# EAGLE design CUI32Stem (EAGLE 5.10)
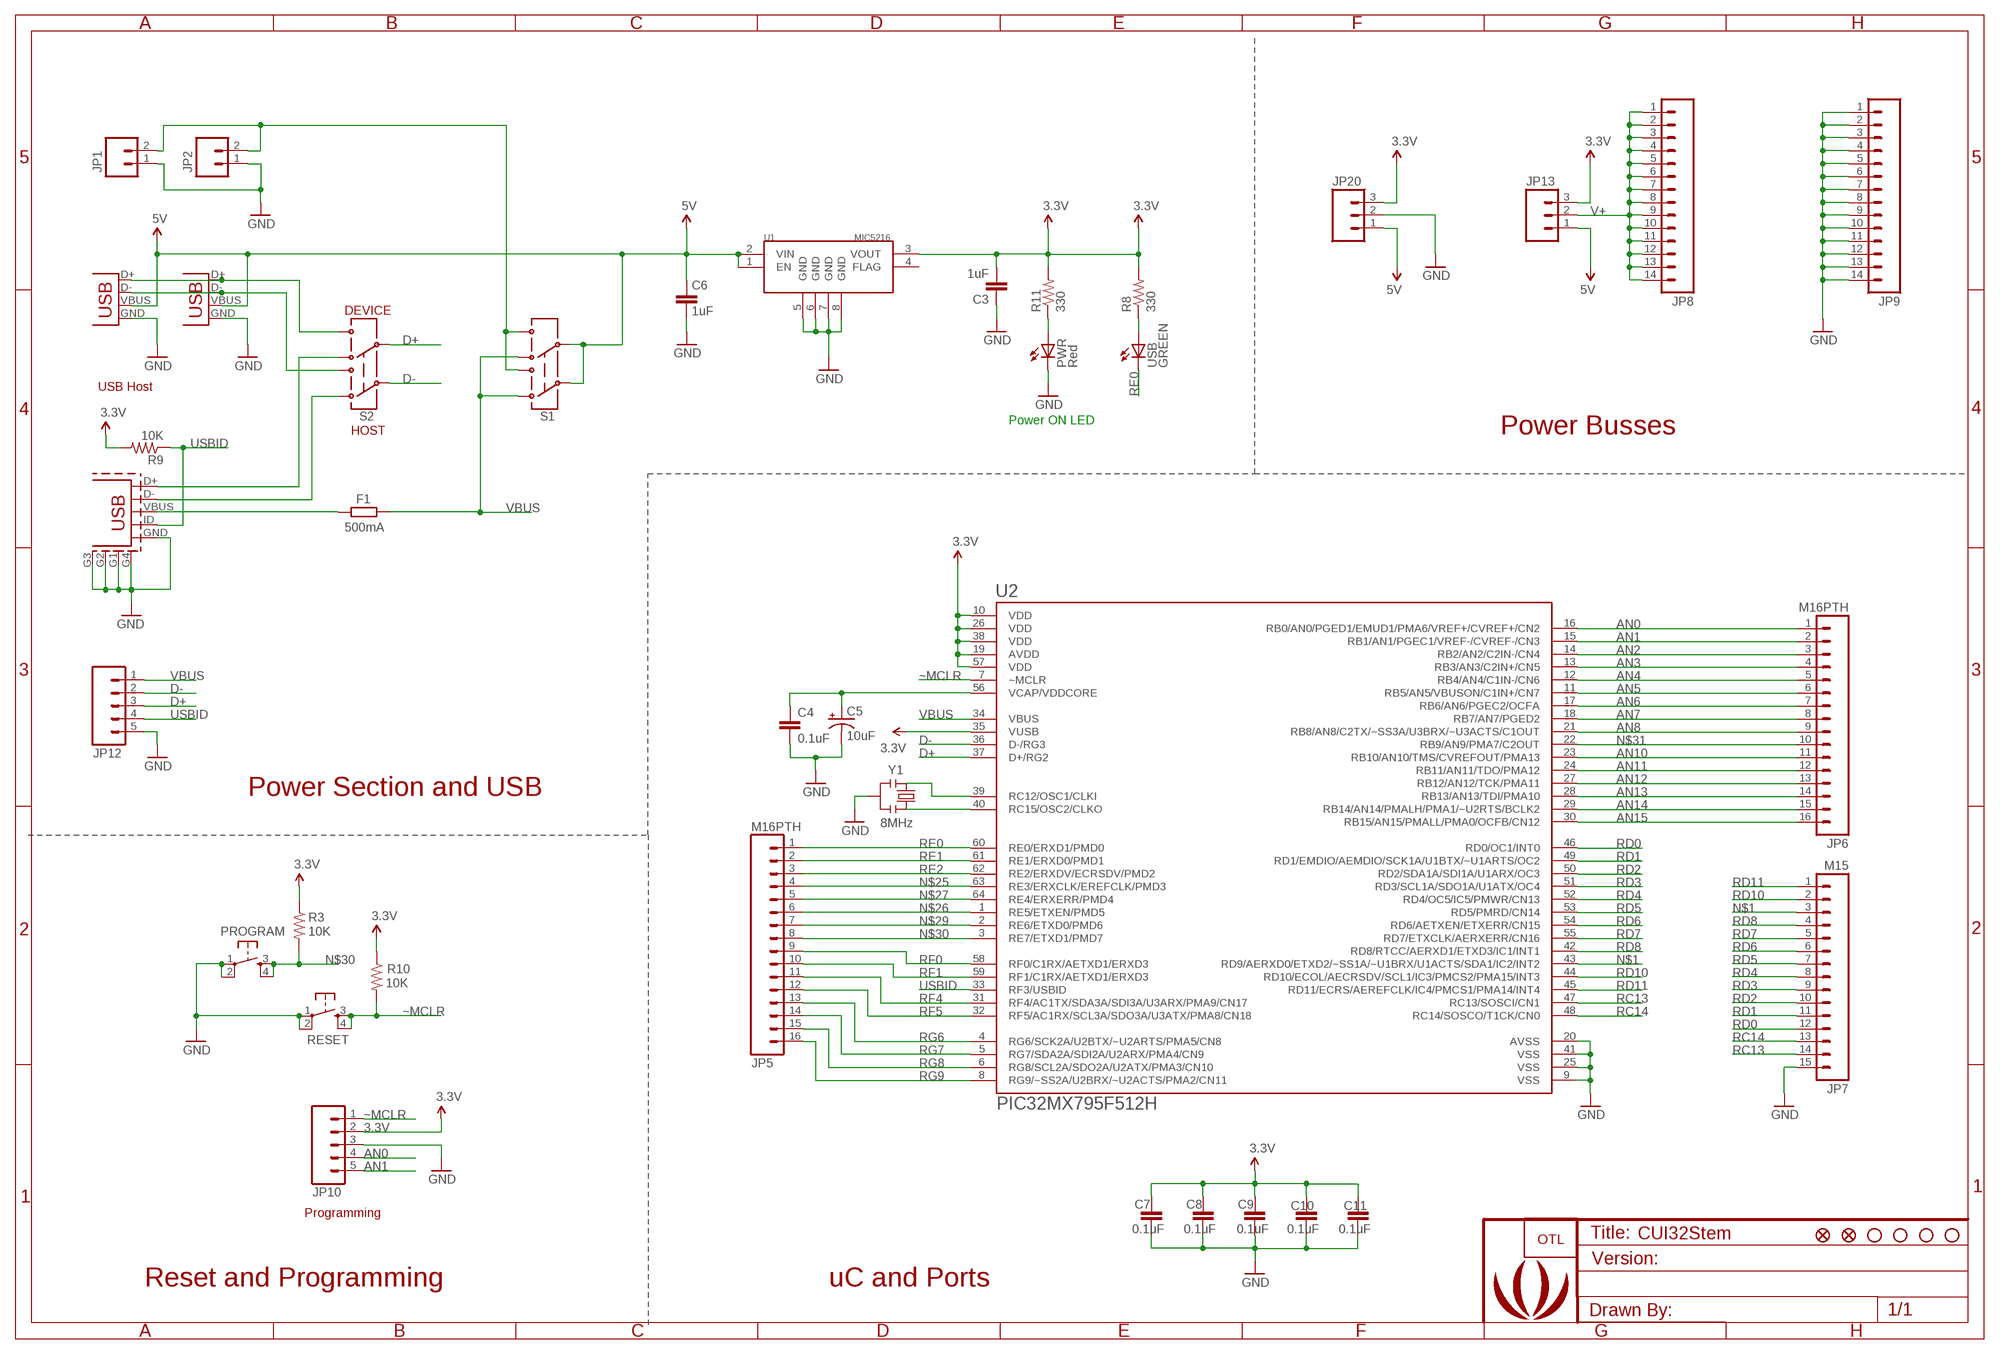
[diagram p0: schematic, sheet 1]

## Parts
C3  1uF  CAP0402-CAP  [0402-CAP]
C4  0.1uF  CAP0402-CAP  [0402-CAP]
C5  10uF  CAP_POL1206  [EIA3216]
C6  1uF  CAP0402-CAP  [0402-CAP]
C7  0.1uF  CAP0402-CAP  [0402-CAP]
C8  0.1uF  CAP0402-CAP  [0402-CAP]
C9  0.1uF  CAP0402-CAP  [0402-CAP]
C10  0.1uF  CAP0402  [C0402]
C11  0.1uF  CAP0402-CAP  [0402-CAP]
F1  500mA  R-EU_R1206  [R1206]
JP1  M02-JST-2MM-SMT  [S2B-PH]
JP2  M02PTH  [1X02]
JP3  USB_5PIN  [USB-MINIB]
JP4  FIDUCIAL1X2  [FIDUCIAL-1X2]
JP5  M16PTH  [1X16]
JP6  M16PTH  [1X16]
JP7  M15  [1X15]
JP8  M14  [1X14]
JP9  M14  [1X14]
JP10  M05PTH  [1X05]
JP11  USB  [USB-A-S-NOSILK-FEMALE]
JP12  M05PTH  [1X05]
JP13  M03PTH  [1X03]
JP14  STAND-OFF  [STAND-OFF]
JP15  STAND-OFF  [STAND-OFF]
JP16  STAND-OFF  [STAND-OFF]
JP17  STAND-OFF  [STAND-OFF]
JP18  FIDUCIAL1X2  [FIDUCIAL-1X2]
JP19  USB  [USB-A-S-NOSILK-FEMALE]
JP20  M03PTH  [1X03]
PROGRAM  TAC_SWITCHSND  [TACTILE_SWITCH_SMD]
PWR  Red  LED0603  [LED-0603]
R3  10K  RESISTOR0402-RES  [0402-RES]
R8  330  RESISTOR0402-RES  [0402-RES]
R9  10K  RESISTOR0402-RES  [0402-RES]
R10  10K  RESISTOR0402-RES  [0402-RES]
R11  330  RESISTOR0402-RES  [0402-RES]
RESET  TAC_SWITCHSND  [TACTILE_SWITCH_SMD]
S1  AYZ0202  [AYZ0202]
S2  AYZ0202  [AYZ0202]
U1  MIC5216  VREG_MIC5216  [MSOP8]
U2  PIC32MX795F512H  [SQFP-S-10X10-64]
U$2  LOGO-SEEEDSTUDIO-SILK  [LOGO_SILK]
U$5  LOGO-OTL  [OVERTONE_LOGO]
USB  GREEN  LED0603  [LED-0603]
Y1  8MHz  RESONATORSMD  [RESONATOR-SMD]

## Nets
3.3V: C3.2 C7.1 C8.1 C9.1 C10.1 C11.1 JP10.2 JP13.3 JP20.3 R3.1 R8.2 R9.2 R10.1 R11.2 U1.3(VOUT) U2.10(VDD) U2.19(AVDD) U2.26(VDD) U2.35(VUSB) U2.38(VDD) U2.57(VDD)
5V: C6.2 JP11.VBUS JP13.1 JP19.VBUS JP20.1 S1.2 S1.5 U1.1(EN) U1.2(VIN)
5V_ALT: JP1.2 JP2.2 S1.1 S1.4
AN0: JP6.1 JP10.4 U2.16(RB0/AN0/PGED1/EMUD1/PMA6/VREF+/CVREF+/CN2)
AN1: JP6.2 JP10.5 U2.15(RB1/AN1/PGEC1/VREF-/CVREF-/CN3)
AN2: JP6.3 U2.14(RB2/AN2/C2IN-/CN4)
AN3: JP6.4 U2.13(RB3/AN3/C2IN+/CN5)
AN4: JP6.5 U2.12(RB4/AN4/C1IN-/CN6)
AN5: JP6.6 U2.11(RB5/AN5/VBUSON/C1IN+/CN7)
AN6: JP6.7 U2.17(RB6/AN6/PGEC2/OCFA)
AN7: JP6.8 U2.18(RB7/AN7/PGED2)
AN8: JP6.9 U2.21(RB8/AN8/C2TX/~SS3A/U3BRX/~U3ACTS/C1OUT)
AN10: JP6.11 U2.23(RB10/AN10/TMS/CVREFOUT/PMA13)
AN11: JP6.12 U2.24(RB11/AN11/TDO/PMA12)
AN12: JP6.13 U2.27(RB12/AN12/TCK/PMA11)
AN13: JP6.14 U2.28(RB13/AN13/TDI/PMA10)
AN14: JP6.15 U2.29(RB14/AN14/PMALH/PMA1/~U2RTS/BCLK2)
AN15: JP6.16 U2.30(RB15/AN15/PMALL/PMA0/OCFB/CN12)
D+: JP12.3 S2.5 U2.37(D+/RG2)
D-: JP12.2 S2.2 U2.36(D-/RG3)
GND: C3.1 C4.2 C5.C(-) C6.1 C7.2 C8.2 C9.2 C10.2 C11.2 JP1.1 JP2.1 JP3.G1 JP3.G2 JP3.G3 JP3.G4(SHIELD) JP3.GND JP7.15 JP9.1 JP9.2 JP9.3 JP9.4 JP9.5 JP9.6 JP9.7 JP9.8 JP9.9 JP9.10 JP9.11 JP9.12 JP9.13 JP9.14 JP10.3 JP11.GND JP12.5 JP19.GND JP20.2 PROGRAM.1 PROGRAM.2 PWR.C RESET.1 RESET.2 U1.5(GND) U1.6(GND) U1.7(GND) U1.8(GND) U2.9(VSS) U2.20(AVSS) U2.25(VSS) U2.41(VSS) Y1.2
N$1: JP7.3 U2.43(RD9/AERXD0/ETXD2/~SS1A/~U1BRX/U1ACTS/SDA1/IC2/INT2)
N$2: F1.1 JP3.VBUS
N$3: JP11.D+ JP19.D+ S2.4
N$4: JP11.D- JP19.D- S2.1
N$5: JP3.D+ S2.6
N$6: PWR.A R11.1
N$7: U2.40(RC15/OSC2/CLKO) Y1.3
N$8: JP3.D- S2.3
N$9: U2.39(RC12/OSC1/CLKI) Y1.1
N$20: R8.1 USB.A
N$25: JP5.4 U2.63(RE3/ERXCLK/EREFCLK/PMD3)
N$26: JP5.6 U2.1(RE5/ETXEN/PMD5)
N$27: JP5.5 U2.64(RE4/ERXERR/PMD4)
N$29: JP5.7 U2.2(RE6/ETXD0/PMD6)
N$30: JP5.8 PROGRAM.3 PROGRAM.4 R3.2 U2.3(RE7/ETXD1/PMD7)
N$31: JP6.10 U2.22(RB9/AN9/PMA7/C2OUT)
N$110: C4.1 C5.A(+) U2.56(VCAP/VDDCORE)
RC13: JP7.14 U2.47(RC13/SOSCI/CN1)
RC14: JP7.13 U2.48(RC14/SOSCO/T1CK/CN0)
RD0: JP7.12 U2.46(RD0/OC1/INT0)
RD1: JP7.11 U2.49(RD1/EMDIO/AEMDIO/SCK1A/U1BTX/~U1ARTS/OC2)
RD2: JP7.10 U2.50(RD2/SDA1A/SDI1A/U1ARX/OC3)
RD3: JP7.9 U2.51(RD3/SCL1A/SDO1A/U1ATX/OC4)
RD4: JP7.8 U2.52(RD4/OC5/IC5/PMWR/CN13)
RD5: JP7.7 U2.53(RD5/PMRD/CN14)
RD6: JP7.6 U2.54(RD6/AETXEN/ETXERR/CN15)
RD7: JP7.5 U2.55(RD7/ETXCLK/AERXERR/CN16)
RD8: JP7.4 U2.42(RD8/RTCC/AERXD1/ETXD3/IC1/INT1)
RD10: JP7.2 U2.44(RD10/ECOL/AECRSDV/SCL1/IC3/PMCS2/PMA15/INT3)
RD11: JP7.1 U2.45(RD11/ECRS/AEREFCLK/IC4/PMCS1/PMA14/INT4)
RE0: JP5.1 U2.60(RE0/ERXD1/PMD0) USB.C
RE1: JP5.2 U2.61(RE1/ERXD0/PMD1)
RE2: JP5.3 U2.62(RE2/ERXDV/ECRSDV/PMD2)
RF0: JP5.9 U2.58(RF0/C1RX/AETXD1/ERXD3)
RF1: JP5.10 U2.59(RF1/C1RX/AETXD1/ERXD3)
RF4: JP5.11 U2.31(RF4/AC1TX/SDA3A/SDI3A/U3ARX/PMA9/CN17)
RF5: JP5.12 U2.32(RF5/AC1RX/SCL3A/SDO3A/U3ATX/PMA8/CN18)
RG6: JP5.13 U2.4(RG6/SCK2A/U2BTX/~U2ARTS/PMA5/CN8)
RG7: JP5.14 U2.5(RG7/SDA2A/SDI2A/U2ARX/PMA4/CN9)
RG8: JP5.15 U2.6(RG8/SCL2A/SDO2A/U2ATX/PMA3/CN10)
RG9: JP5.16 U2.8(RG9/~SS2A/U2BRX/~U2ACTS/PMA2/CN11)
USBID: JP3.ID(USB_ID) JP12.4 R9.1 U2.33(RF3/USBID)
V+: JP8.1 JP8.2 JP8.3 JP8.4 JP8.5 JP8.6 JP8.7 JP8.8 JP8.9 JP8.10 JP8.11 JP8.12 JP8.13 JP8.14 JP13.2
VBUS: F1.2 JP12.1 S1.3 S1.6 U2.34(VBUS)
~MCLR: JP10.1 R10.2 RESET.3 RESET.4 U2.7(~MCLR)
Unconnected: U1.4(FLAG)

## Notes on the sheet
- DEVICE
- USB Host
- Power ON LED
- HOST | Power Busses
- Power Section and USB
- Programming
- Reset and Programming | uC and Ports

## Library data of the parts
C3 C4 C6-C9 C11 = SparkFun:CAP: Capacitor Standard 0603 ceramic capacitor, and 0.1" leaded capacitor.
C5 = SparkFun02-20-08:CAP_POL: Capacitor Polarized These are standard SMD and PTH capacitors. Normally 10uF, 47uF, and 100uF in electrolytic and tantalum varieties. Always verify the external diameter of the through hole cap, it varies with capacity, voltage, and manufacturer. The EIA devices should be standard.
C10 = SparkFun02-20-08:CAP: Capacitor Standard 0603 ceramic capacitor, and 0.1" leaded capacitor.
F1 = resistor:R-EU_: RESISTOR, European symbol
JP1 JP2 = SparkFun:M02: Header 2 Standard 2-pin 0.1" header. Use with straight break away headers (SKU : PRT-00116), right angle break away headers (PRT-00553), swiss pins (PRT-00743), machine pins (PRT-00117), and female headers (PRT-00115). Molex polarized connector foot print use with SKU : PRT-08233 with associated crimp pins and housings.
JP3 = SparkFun02-20-08:USB_5PIN
JP4 JP18 = SparkFun:FIDUCIAL: Fiducial Alignment Points Various fiducial points for machine vision alignment.
JP5 JP6 = SparkFun:M16
JP7 = SparkFun:M15: Header 15 Standard 15-pin 0.1" header. Use with straight break away headers (SKU : PRT-00116), right angle break away headers (PRT-00553), swiss pins (PRT-00743), machine pins (PRT-00117), and female headers (PRT-00115).
JP8 JP9 = SparkFun:M14: Header 14 Standard 14-pin 0.1" header. Use with straight break away headers (SKU : PRT-00116), right angle break away headers (PRT-00553), swiss pins (PRT-00743), machine pins (PRT-00117), and female headers (PRT-00115).
JP10 JP12 = SparkFun:M05: Header 5 Standard 5-pin 0.1" header. Use with straight break away headers (SKU : PRT-00116), right angle break away headers (PRT-00553), swiss pins (PRT-00743), machine pins (PRT-00117), and female headers (PRT-00115). Molex polarized connector foot print use with SKU : PRT-08230 with associated crimp pins and housings.
JP11 JP19 = SparkFun:USB: USB Connectors USB-B-PTH is fully proven SKU : PRT-00139 USB-miniB is fully proven SKU : PRT-00587 USB-A-PCB is untested. USB-A-H is throughly reviewed, but untested. Spark Fun Electronics SKU : PRT-00437 USB-B-SMT is throughly reviewed, but untested. Needs silkscreen touching up. USB-A-S has not been used/tested USB-MB-H has not been used/tested
JP13 JP20 = SparkFun:M03: Header 3 Standard 3-pin 0.1" header. Use with straight break away headers (SKU : PRT-00116), right angle break away headers (PRT-00553), swiss pins (PRT-00743), machine pins (PRT-00117), and female headers (PRT-00115). Molex polarized connector foot print use with SKU : PRT-08232 with associated crimp pins and housings.
JP14-JP17 = SparkFun:STAND-OFF: Stand Off This is the mechanical footprint for a #4 phillips button head screw. Use the keepout ring to avoid running the screw head into surrounding components. SKU : PRT-00447
PROGRAM RESET = SparkFun02-20-08:TAC_SWITCH: Momentary Switch Button commonly used for reset or general input. Spark Fun Electronics SKU : COM-00097
PWR USB = SparkFun:LED: LEDs Standard schematic elements and footprints for 5mm, 3mm, 1206, and 0603 sized LEDs. 5mm - Spark Fun Electronics SKU : COM-00529 (and others)
R3 R8-R11 = SparkFun:RESISTOR: Resistor Basic schematic elements and footprints for 0603, 1206, and PTH 1/10th watt (small) resistors.
S1 S2 = SparkFun:AYZ0202: SPDT Slide Switch Simple SMD single-pull double-throw slide switch. Good for less than 350mA power switch, switching UARTs between devices, etc. Spark Fun Electronics SKU : COM-00597
U1 = SparkFun:VREG_MIC5216: 500mA LDO, MSOP8 for better dissipation
U2 = SparkFun:PIC32MX795F512H
U$2 = Logo:LOGO-SEEEDSTUDIO
U$5 = SparkFun:LOGO-OTL
Y1 = SparkFun02-20-08:RESONATOR: Resonator Small SMD resonator. This is the itty bitty 10/20MHz resonators with built in caps. CSTCE10M0G55 and CSTCE20M0V53. Footprint has been reviewed closely but hasn't been tested yet.

## Board
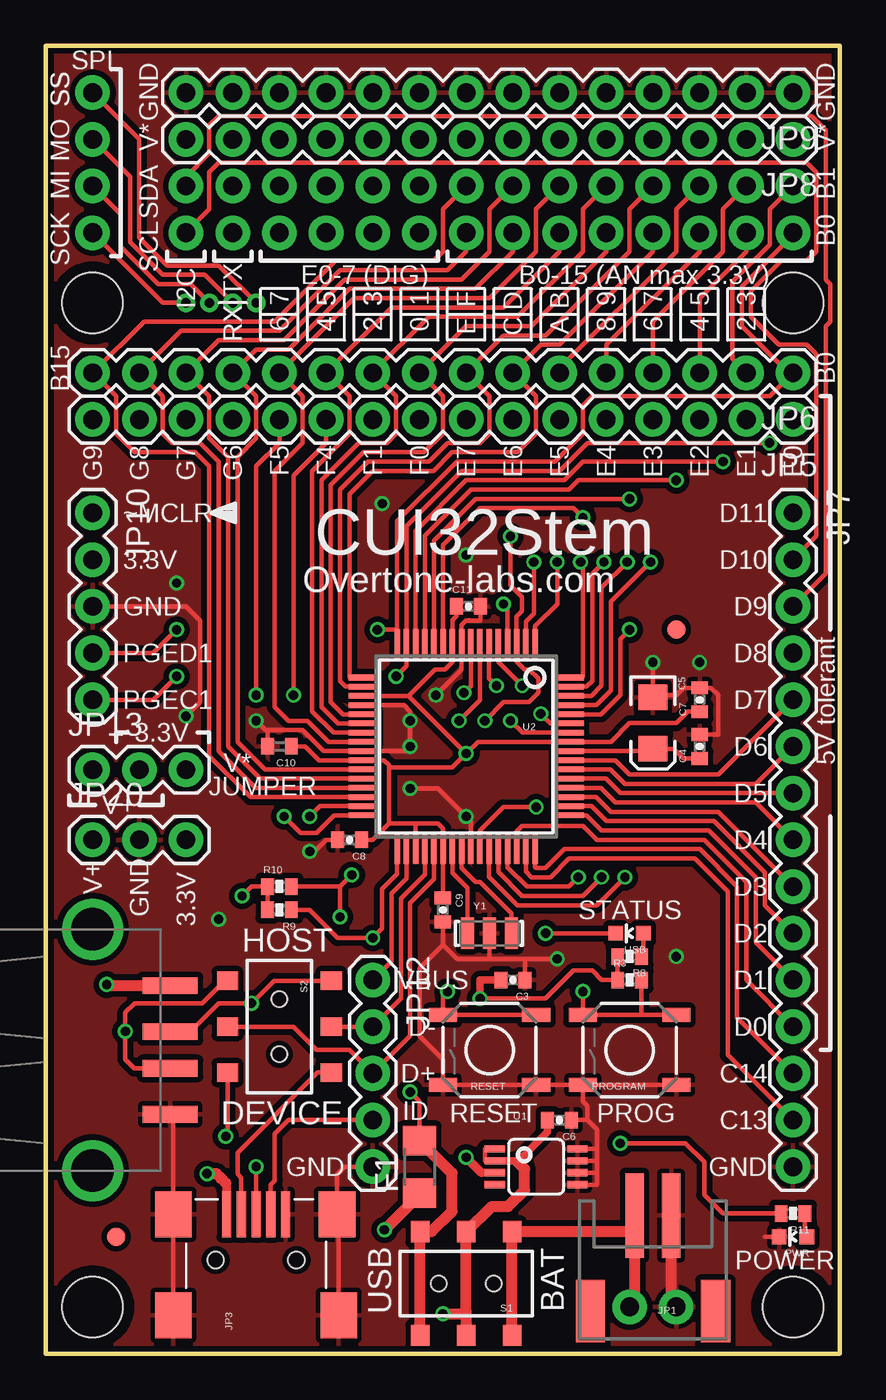
[diagram p1: board, top side]
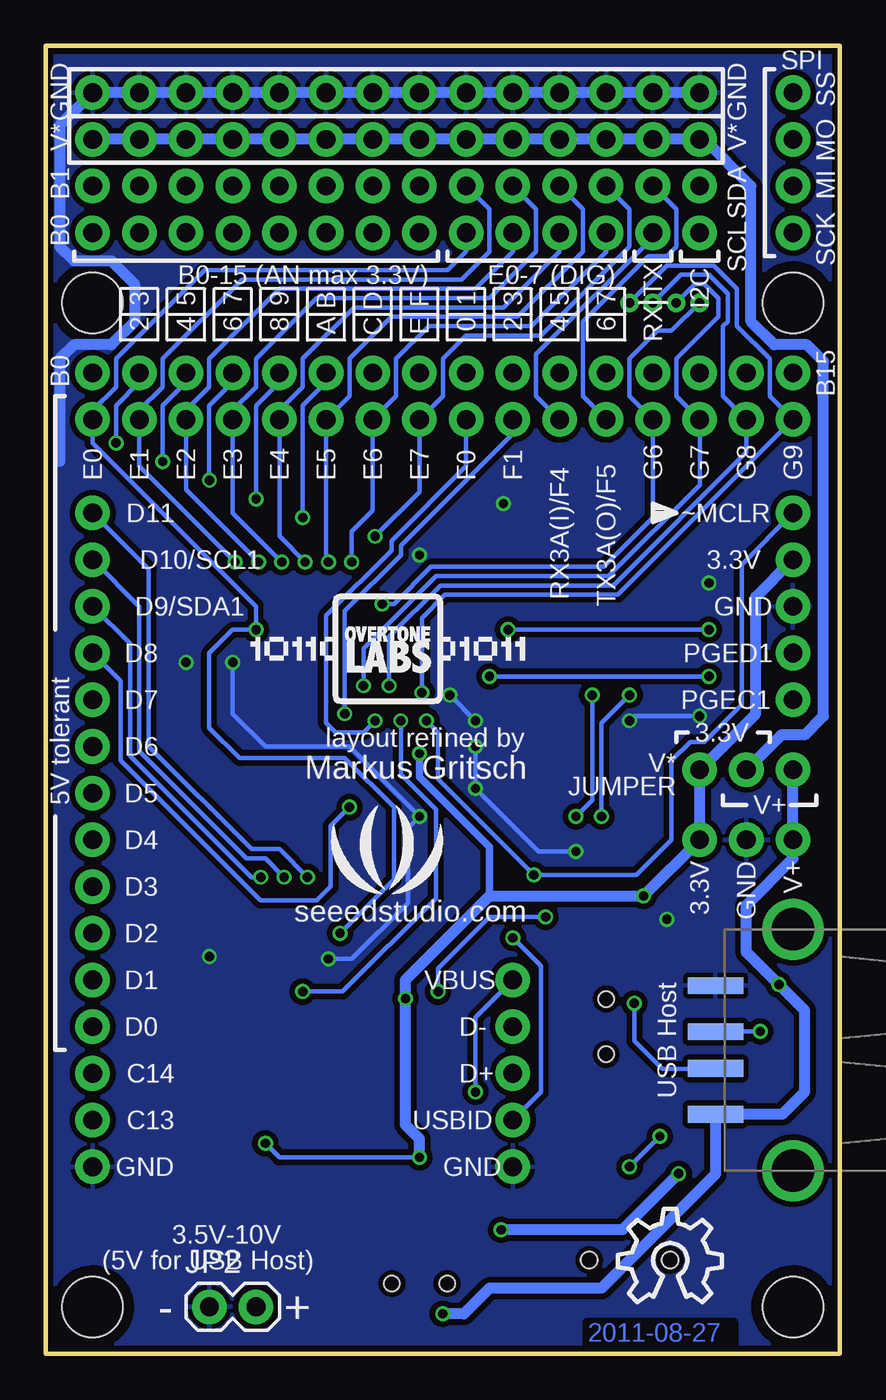
[diagram p2: board, bottom side, seen from below]

Size 43.18 x 71.12 mm. Coordinates in mm from the lower left corner, seen from the top.
Outline: 0,0 43.18,0 43.18,71.12 0,71.12 0,0
Copper layers (1*16): Top 0.035mm / dielectric 1.5mm / Bottom 0.035mm
Design rules "Fusion_eagle_rule_v1.1": minimum track width 6mil, minimum drill 12mil, track to track 6mil, track to pad 6mil, pad to pad 6mil, via to via 6mil, smd to smd 0mil, copper to edge 10mil, drill to drill 10mil, minimum pad ring 10mil, minimum via ring 6mil, stop-mask expansion 2mil, vias tented up to drill 100mil, thermal gap 10mil

### Footprints (pad centres in the part's own frame; a part is rotated, then mirrored left to right if it is on the bottom)
0402-CAP = smd 0.7 x 0.9: 1 -0.65,0; 2 0.65,0
EIA3216 = smd 1.4 x 1.6: A 1.4,0; C -1.4,0
C0402 = smd 0.7 x 0.9: 1 -0.65,0; 2 0.65,0
R1206 = smd 1.6 x 1.803: 1 -1.422,0; 2 1.422,0
S2B-PH = smd 1 x 4.6: 1 -1,-3.7; 2 1,-3.7 | smd 1.6 x 3.4: NC1 -3.4,1.5; NC2 3.4,1.5
1X02 = drill 1.016 pad 1.88 round: 1 0,0; 2 2.54,0
USB-MINIB = smd 2.5 x 0.5: D+ 2.5,0; D- 2.5,0.8; GND 2.5,-1.6; ID 2.5,-0.8; VBUS 2.5,1.6 | smd 2.5 x 2: G1 -3,4.5; G2 2.5,4.5; G3 -3,-4.5; G4 2.5,-4.4 | hole 0.9: 0,2.2; 0,-2.2
FIDUCIAL-1X2 = smd 1 x 1: 1 0,0
1X16 = drill 1.016 pad 1.88 round: 1 0,0; 2 2.54,0; 3 5.08,0; 4 7.62,0; 5 10.16,0; 6 12.7,0; 7 15.24,0; 8 17.78,0; 9 20.32,0; 10 22.86,0; 11 25.4,0; 12 27.94,0; 13 30.48,0; 14 33.02,0; 15 35.56,0; 16 38.1,0
1X15 = drill 1.016 pad 1.88 round: 1 0,0; 2 2.54,0; 3 5.08,0; 4 7.62,0; 5 10.16,0; 6 12.7,0; 7 15.24,0; 8 17.78,0; 9 20.32,0; 10 22.86,0; 11 25.4,0; 12 27.94,0; 13 30.48,0; 14 33.02,0; 15 35.56,0
1X14 = drill 1.016 pad 1.88 round: 1 0,0; 2 2.54,0; 3 5.08,0; 4 7.62,0; 5 10.16,0; 6 12.7,0; 7 15.24,0; 8 17.78,0; 9 20.32,0; 10 22.86,0; 11 25.4,0; 12 27.94,0; 13 30.48,0; 14 33.02,0
1X05 = drill 1.016 pad 1.88 round: 1 0,0; 2 2.54,0; 3 5.08,0; 4 7.62,0; 5 10.16,0
USB-A-S-NOSILK-FEMALE = smd 3 x 0.9: D+ 4.212,-1; D- 4.212,1; GND 4.212,-3.5; VBUS 4.212,3.5 | drill 2.311 round: P$5 0,-6.566; P$6 0,6.566
1X03 = drill 1.016 pad 1.88 round: 1 0,0; 2 2.54,0; 3 5.08,0
STAND-OFF = hole 3.302: 0,0
TACTILE_SWITCH_SMD = smd 1.524 x 0.762: 1 -2.54,1.905; 2 2.54,1.905; 3 -2.54,-1.905; 4 2.54,-1.905
LED-0603 = smd 0.8 x 0.8: A 0,-0.75; C 0,0.75
0402-RES = smd 0.7 x 0.9: 1 -0.65,0; 2 0.65,0
AYZ0202 = smd 1 x 1.15: 1 -2.5,2.825; 2 0,2.825; 3 2.5,2.825; 4 -2.5,-2.825; 5 0,-2.825; 6 2.5,-2.825 | hole 0.85: 1.5,0; -1.5,0
MSOP8 = smd 0.4 x 1.1: 1 -0.975,-2.25; 2 -0.325,-2.25; 3 0.325,-2.25; 4 0.975,-2.25; 5 0.975,2.25; 6 0.325,2.25; 7 -0.325,2.25; 8 -0.975,2.25
SQFP-S-10X10-64@1 = smd 0.3 x 1.6: 1 -3.75,-5.6; 2 -3.25,-5.6; 3 -2.75,-5.6; 4 -2.25,-5.6; 5 -1.75,-5.6; 6 -1.25,-5.6; 7 -0.75,-5.6; 8 -0.25,-5.6; 9 0.25,-5.6; 10 0.75,-5.6; 11 1.25,-5.6; 12 1.75,-5.6; 13 2.25,-5.6; 14 2.75,-5.6; 15 3.25,-5.6; 16 3.75,-5.6; 33 3.75,5.6; 34 3.25,5.6; 35 2.75,5.6; 36 2.25,5.6; 37 1.75,5.6; 38 1.25,5.6; 39 0.75,5.6; 40 0.25,5.6; 41 -0.25,5.6; 42 -0.75,5.6; 43 -1.25,5.6; 44 -1.75,5.6; 45 -2.25,5.6; 46 -2.75,5.6; 47 -3.25,5.6; 48 -3.75,5.6 | smd 1.6 x 0.3: 17 5.6,-3.75; 18 5.6,-3.25; 19 5.6,-2.75; 20 5.6,-2.25; 21 5.6,-1.75; 22 5.6,-1.25; 23 5.6,-0.75; 24 5.6,-0.25; 25 5.6,0.25; 26 5.6,0.75; 27 5.6,1.25; 28 5.6,1.75; 29 5.6,2.25; 30 5.6,2.75; 31 5.6,3.25; 32 5.6,3.75; 49 -5.6,3.75; 50 -5.6,3.25; 51 -5.6,2.75; 52 -5.6,2.25; 53 -5.6,1.75; 54 -5.6,1.25; 55 -5.6,0.75; 56 -5.6,0.25; 57 -5.6,-0.25; 58 -5.6,-0.75; 59 -5.6,-1.25; 60 -5.6,-1.75; 61 -5.6,-2.25; 62 -5.6,-2.75; 63 -5.6,-3.25; 64 -5.6,-3.75
RESONATOR-SMD = smd 0.7 x 1.7: 1 -1.2,0; 2 0,0; 3 1.2,0

### Placement (x,y rotation side)
C3  25.4,20.32 180 top
C4  35.56,33.02 90 top
C5  33.02,34.29 270 top
C6  27.94,12.7 180 top
C7  35.56,35.56 90 top
C8  16.51,27.94 180 top
C9  21.59,24.13 270 top
C10  12.7,33.02 180 top
C11  22.99,40.64 0 top
F1  20.32,10.16 90 top
JP1  33.02,3.81 180 top
JP2  34.29,2.54 0 bottom
JP3  11.43,5.08 90 top
JP4  3.81,6.35 0 top
JP5  40.64,50.8 180 top
JP6  40.64,53.34 180 top
JP7  40.64,45.72 270 top
JP8  40.64,66.04 180 top
JP9  40.64,68.58 180 top
JP10  2.54,45.72 270 top
JP11  2.54,16.51 180 bottom
JP12  17.78,20.32 270 top
JP13  2.54,31.75 0 top
JP14  40.64,2.54 0 top
JP15  2.54,2.54 0 top
JP16  2.54,57.15 0 top
JP17  40.64,57.15 0 top
JP18  34.29,39.37 0 top
JP19  2.54,16.51 0 top
JP20  2.54,27.94 0 top
PROGRAM  31.75,16.51 180 top
PWR  40.64,6.35 90 top
R3  31.75,20.32 0 top
R8  31.75,21.59 180 top
R9  12.7,24.13 180 top
R10  12.7,25.4 0 top
R11  40.64,7.62 180 top
RESET  24.13,16.51 180 top
S1  22.86,3.81 180 top
S2  12.7,17.78 270 top
U1  26.67,10.16 270 top
U2  PIC32MX795F512H  [SQFP-S-10X10-64@1]  22.86,33.02 180 top
U$2  24.64,26.67 0 bottom
U$4  [OSHW_10X200_NOTEXT]  12.06,2.79 0 bottom
U$5  24.64,38.23 0 bottom
USB  31.75,22.86 90 top
Y1  24.13,22.86 0 top

### Tracks (layer width: path | path; a pad name or v marks a point on that pad's centre or on a via)
3.3V  (via drill 0.51)
  Top 0.254: U2.35 20.11,28.79 20.07,28.83 | 19.73,35.77 U2.19 | 19.73,35.77 21.17,37.21 21.72,37.21 22.11,37.6 U2.10 22.11,39.89 22.34,40.12 C11.1 | v22.86,32.64 23.49,33.27 U2.57 30.73,33.27 31.75,34.29 34.29,34.29 34.91,34.91 C7.1 | v22.86,32.64 19.73,35.77 | 18.67,31.88 18.67,28.83 | v22.86,32.64 22.1,31.88 18.67,31.88 | 20.07,28.83 21.34,28.83 21.61,28.55 U2.38 21.61,25.55 21.59,25.53 C9.1 | R8.2 R3.1 30.23,20.32 29.72,20.83 28.7,20.83 27.18,19.3 v23.62,19.3 | R9.2 R10.1 11.18,25.4 v10.67,24.89 | R11.2 36.83,7.62 35.81,8.64 35.81,10.41 34.8,11.43 v31.24,11.43 | C10.1 14.1,33.02 14.85,32.27 U2.26 18.4,32.27 18.67,32 18.67,31.88 | C8.1 17.78,27.94 18.67,28.83 | 18.67,28.83 20.07,28.83
  Top 0.406: v23.62,19.3 23.62,20.32 C3.2 | U1.3 23.69,9.84
  Top 0.457: 23.69,9.84 v22.86,10.67
  Bottom 0.254: v31.24,11.43 30.48,10.67 v22.86,10.67
  Bottom 0.406: v22.86,32.64 22.86,31.37 19.05,27.56 19.05,24.89
  Bottom 0.61: JP10.2 4.57,41.15 4.57,34.8 JP13.3 JP20.3 v10.67,24.89 19.05,24.89 23.62,20.32 v23.62,19.3 23.62,12.45 22.86,11.68 v22.86,10.67
5V  (via drill 0.51)
  Top 0.254: U1.2 23.88,10.48 23.88,11.13 U1.1
  Top 0.406: U1.2 25.58,10.48 25.65,10.41 27.29,12.05 C6.2
  Top 0.61: 22.86,2.29 S1.2 | 22.86,2.29 S1.5 22.89,6.63 24.26,8 25.15,8 26.04,8.89 26.04,10.03 25.65,10.41 | v21.59,2.16 22.73,2.16 22.86,2.29 | JP19.VBUS 3.3,20.01 v3.3,20.07
  Bottom 0.61: JP13.1 JP20.1 2.54,26.92 5.08,24.38 5.08,21.84 v3.3,20.07 1.91,18.67 1.91,14.22 3.12,13.01 JP11.VBUS 6.75,9.76 12.95,3.56 19.05,3.56 20.45,2.16 v21.59,2.16
5V_ALT
  Top 0.61: 32.02,6.35 32.02,2.81 JP2.2 | 32.02,6.35 JP1.2 | 32.02,6.35 31.73,6.63 S1.4 S1.1
AN0  (via drill 0.51, 1.02 pad 1.88)
  Top 0.254: JP10.4 5.84,38.1 v7.11,39.37 | 19.11,39.37 U2.16 | 19.11,39.37 19.11,45.27 22.35,48.51 27.69,48.51 29.21,50.04 29.21,51.56 29.72,52.07 39.37,52.07 JP6.1 40.39,53.34 37.85,55.88 37.85,58.04 40.64,60.83 v40.64,60.96 | v18.03,39.37 19.11,39.37
  Bottom 0.254: v7.11,39.37 v18.03,39.37
AN1  (via drill 0.51, 1.02 pad 1.88)
  Top 0.254: JP10.5 5.84,35.56 v7.11,36.83 | v19.05,36.83 19.61,37.39 U2.15 19.61,45.01 22.61,48.01 27.94,48.01 29.46,49.53 v39.37,49.53 | v40.64,63.5 39.37,62.23 39.37,60.33 37.34,58.29 37.34,54.1 JP6.2
  Bottom 0.254: v39.37,49.53 39.37,51.56 38.1,52.83 JP6.2 | v7.11,36.83 v19.05,36.83
AN2  (via drill 0.51, 1.02 pad 1.88)
  Top 0.254: U2.14 20.11,44.75 22.86,47.5 28.19,47.5 29.21,48.51 v36.83,48.51 | v38.1,60.96 38.1,59.94 35.56,57.4 JP6.3
  Bottom 0.254: v36.83,48.51 36.83,51.56 35.56,52.83 JP6.3
AN3  (via drill 0.51, 1.02 pad 1.88)
  Top 0.254: U2.13 20.61,44.49 23.11,46.99 28.45,46.99 28.96,47.5 v34.29,47.5 | JP6.4 33.02,56.13 36.83,59.94 36.83,62.23 v38.1,63.5
  Bottom 0.254: v34.29,47.5 34.29,51.56 33.02,52.83 JP6.4
AN4  (via drill 0.51, 1.02 pad 1.88)
  Top 0.254: U2.12 21.11,44.22 23.37,46.48 v31.75,46.48 | JP6.5 30.48,54.86 35.56,59.94 v35.56,60.96
  Bottom 0.254: v31.75,46.48 31.75,51.56 30.48,52.83 JP6.5
AN5  (via drill 0.51, 1.02 pad 1.88)
  Top 0.254: U2.11 21.61,43.96 23.62,45.97 28.7,45.97 v29.21,45.47 | v35.56,63.5 34.29,62.23 34.29,59.94 27.94,53.59 JP6.6
  Bottom 0.254: v29.21,45.47 29.21,51.56 27.94,52.83 JP6.6
AN6  (via drill 1.02 pad 1.88)
  Top 0.254: U2.17 16.51,36.77 16.51,46.74 17.78,48.01 21.08,48.01 22.1,49.02 25.65,49.02 26.67,50.04 26.67,52.07 JP6.7 26.92,54.86 27.94,54.86 33.02,59.94 v33.02,60.96
AN7  (via drill 1.02 pad 1.88)
  Top 0.254: U2.18 16.31,36.27 16,36.58 16,46.99 17.53,48.51 20.83,48.51 21.84,49.53 23.62,49.53 24.13,50.04 24.13,52.07 JP6.8 24.89,55.37 27.18,55.37 31.75,59.94 31.75,62.23 v33.02,63.5
AN8  (via drill 1.02 pad 1.88)
  Top 0.254: U2.21 16.16,34.77 15.49,35.43 15.49,47.24 17.27,49.02 20.57,49.02 21.59,50.04 21.59,52.07 JP6.9 22.86,55.88 26.42,55.88 30.48,59.94 v30.48,60.96
AN10  (via drill 1.02 pad 1.88)
  Top 0.254: U2.23 15.63,33.77 14.48,34.92 14.48,48.01 16.51,50.04 16.51,52.07 JP6.11 18.8,56.9 24.89,56.9 27.94,59.94 v27.94,60.96
AN11  (via drill 1.02 pad 1.88)
  Top 0.254: U2.24 15.37,33.27 14.22,34.42 13.21,34.42 12.45,35.18 12.45,48.01 13.97,49.53 13.97,52.07 JP6.12 16.76,57.4 24.13,57.4 26.67,59.94 26.67,62.23 v27.94,63.5
AN12  (via drill 1.02 pad 1.88)
  Top 0.254: U2.27 11.92,31.77 10.41,33.27 10.41,48.77 11.43,49.78 11.43,52.07 JP6.13 11.43,54.61 13.21,54.61 16.51,57.91 23.37,57.91 25.4,59.94 v25.4,60.96
AN13  (via drill 1.02 pad 1.88)
  Top 0.254: U2.28 11.66,31.27 9.91,33.02 9.91,48.77 8.89,49.78 8.89,52.07 JP6.14 9.4,55.12 12.95,55.12 16.26,58.42 22.61,58.42 24.13,59.94 24.13,62.23 v25.4,63.5
AN14  (via drill 1.02 pad 1.88)
  Top 0.254: U2.29 11.39,30.77 9.4,32.77 9.4,48.51 8.38,49.53 6.86,49.53 6.35,50.04 6.35,52.07 JP6.15 7.37,55.63 12.7,55.63 16,58.93 21.84,58.93 22.86,59.94 v22.86,60.96
AN15  (via drill 1.02 pad 1.88)
  Top 0.254: U2.30 11.13,30.27 8.89,32.51 8.89,48.26 8.13,49.02 4.83,49.02 3.81,50.04 3.81,52.07 JP6.16 5.33,56.13 12.45,56.13 15.75,59.44 21.08,59.44 21.59,59.94 21.59,62.23 v22.86,63.5
D+
  Top 0.254: U2.37 21.11,25.81 19.81,24.51 19.81,17.27 JP12.3 16.51,16.51 14.73,16.51 13.46,17.78 S2.5
D-
  Top 0.254: U2.36 20.61,26.07 19.3,24.77 19.3,19.3 JP12.2 S2.2
GND  (via drill 0.51)
  Top 0.254: U2.41 23.11,28.96 v22.86,29.21 21.34,30.73 v19.81,30.73 | JP10.3 7.62,40.64 8.38,39.88 8.38,35.43 v7.62,34.67 | PROGRAM.2 PROGRAM.1 | v14.35,27.3 14.61,27.3 15.24,27.94 C8.2 | 26.05,21.46 v27.81,21.46 | 21.59,22.23 C9.2 | 21.59,22.23 22.35,21.46 24.13,21.46 | 24.13,21.46 Y1.2 | PROGRAM.2 RESET.1 RESET.2 21.59,16 20.32,17.27 20.32,20.95 21.59,22.23 | 28.59,12.97 C6.1 29.46,12.7 | JP3.G1 JP3.G2 6.93,12.88 6.86,12.95 | JP3.G3 15.93,7.48 JP3.G4 15.83,9.73 16.26,10.16 JP12.5 | PWR.C 39.12,6.35 | 26.05,21.46 C3.1 | 24.13,21.46 26.05,21.46 | v33.02,37.59 C5.C | 33.02,35.81 34.29,35.81 34.69,36.21 C7.2 36.18,36.21 36.58,35.81 36.58,33.67 C4.2 | PROGRAM.2 29.21,13.72 29.46,13.46 29.46,12.7 | U1.5 29.97,9.19 29.97,9.91 | 29.97,11.18 29.97,12.19 29.46,12.7 | 29.97,11.18 29.97,10.41 | 29.97,10.41 29.97,9.91 | U1.6 29.9,9.84 29.97,9.91 | U1.7 29.9,10.48 29.97,10.41 | U1.8 29.93,11.13 29.97,11.18 | v11.43,34.42 11.94,33.91 13.97,33.91 15.11,32.77 U2.25 19.56,32.77 v19.81,33.02 v19.81,34.42 19.81,34.92 19.47,35.27 U2.20 | C10.2 12.05,33.77 | C11.2 23.64,39.89 23.62,39.88 22.86,39.88 22.61,39.63 U2.9 22.61,37.22 v21.21,35.81
  Top 0.61: JP1.1 34.02,2.81 JP2.1
  Bottom 0.254: v19.81,34.42 v21.21,35.81 | v19.81,33.02 v19.81,30.73 16.38,27.3 v14.35,27.3 | v11.43,34.42 11.18,34.67 v7.62,34.67 | v33.02,37.59 33.02,34.8 31.24,33.02 26.67,33.02 v22.86,29.21 23.5,28.57 23.5,24.51 26.54,21.46 v27.81,21.46
  Bottom 0.61: JP9.14 JP9.13 JP9.12 JP9.11 JP9.10 JP9.9 JP9.8 JP9.7 JP9.6 JP9.5 JP9.4 JP9.3 JP9.2 JP9.1 42.42,66.8 42.42,60.2 41.66,59.44 39.62,59.44 38.35,58.17 38.35,56.13 39.62,54.86 41.66,54.86 42.42,54.1 42.42,48.51
  other vias: 34.29,21.59 9.4,23.62 7.11,41.91 22.86,43.43 18.29,46.23 35.56,37.59
  pour Bottom (isolate 0.305): 0,0 43.18,0 43.18,71.12 0,71.12
  pour Top (isolate 0.305): 0,0 43.18,0 43.18,71.12 0,71.12
N$1  (via drill 0.51, 1.02 pad 1.88)
  Top 0.254: v7.62,63.5 7.62,64.01 8.89,65.28 8.89,66.8 9.4,67.31 41.66,67.31 42.42,66.55 42.42,58.42 42.67,58.17 42.67,56.13 42.42,55.88 42.42,42.42 JP7.3 | 24.13,27.4 U2.43 24.11,25.93 25.65,24.38 29.97,24.38 v31.5,25.91
  Bottom 0.254: v31.5,25.91 32,25.91 38.61,32.51 38.61,38.61 JP7.3
N$2  (via drill 0.51)
  Top 0.457: JP3.VBUS 9.83,9.22 9.53,9.53
  Top 0.61: v8.76,9.78 9.27,9.78 9.53,9.53 9.78,9.27 | v18.41,6.73 20.32,8.64 F1.1
  Bottom 0.61: v18.41,6.73 11.81,6.73 v8.76,9.78
N$3  (via drill 0.51)
  Top 0.254: 9.78,20.32 8.51,19.05 4.83,19.05 4.32,18.54 v4.32,17.53 4.32,16 4.81,15.51 JP19.D+
  Top 0.406: 9.78,20.32 9.88,20.32 S2.4
  Bottom 0.254: v4.32,17.53 6.74,17.53 JP11.D+
N$4  (via drill 0.51)
  Top 0.254: JP19.D- 7.86,17.51 9.4,19.05 v11.18,19.05 12.41,20.28 S2.1
  Bottom 0.254: v11.18,19.05 11.18,17.02 9.65,15.49 6.77,15.49 JP11.D-
N$5  (via drill 0.51)
  Top 0.254: JP3.D+ v11.43,10.16 | S2.6 9.88,11.91 v9.78,11.81
  Bottom 0.254: v11.43,10.16 v9.78,11.81
N$6
  Top 0.254: R11.1 41.29,6.48 41.39,6.38 PWR.A
N$7
  Top 0.254: Y1.3 25.33,23.95 23.62,25.65 23.37,25.65 22.61,26.41 U2.40
N$8
  Top 0.254: JP3.D- 10.63,9.56 10.41,9.78 10.41,10.92 14.77,15.28 S2.3
N$9
  Top 0.254: U2.39 22.11,26.15 22.93,25.33 22.93,23.55 | 22.93,23.55 Y1.1 | 22.93,23.55 22.99,23.5
N$20
  Top 0.254: R8.1 32.5,21.59 USB.A
N$25  (via drill 0.51, 1.02 pad 1.88)
  Top 0.254: U2.63 29.41,36.27 29.72,36.58 29.72,42.42 v30.35,43.05
  Bottom 0.254: v17.78,63.5 16.51,62.23 16.51,59.94 19.05,57.4 28.45,57.4 31.75,54.1 31.75,52.58 33.02,51.31 JP5.4 33.02,45.72 v30.35,43.05
N$26  (via drill 0.51, 1.02 pad 1.88)
  Top 0.254: v27.81,43.05 27.81,40.77 26.61,39.56 U2.1
  Bottom 0.254: v15.24,63.5 13.97,62.23 13.97,59.94 17.53,56.39 24.38,56.39 26.67,54.1 26.67,52.07 JP5.6 27.94,43.18 v27.81,43.05
N$27  (via drill 0.51, 1.02 pad 1.88)
  Top 0.254: U2.64 29.15,36.77 29.21,36.83 29.21,42.93 v29.08,43.05
  Bottom 0.254: v15.24,60.96 15.24,59.94 18.29,56.9 26.42,56.9 29.21,54.1 29.21,52.58 30.48,51.31 JP5.5 30.48,44.45 v29.08,43.05
N$29  (via drill 0.51, 1.02 pad 1.88)
  Top 0.254: U2.2 26.11,39.83 26.54,40.26 v26.54,43.05
  Bottom 0.254: v12.7,60.96 12.7,59.94 16.76,55.88 22.35,55.88 24.13,54.1 24.13,52.07 JP5.7 25.4,45.85 26.54,44.7 v26.54,43.05
N$30  (via drill 0.51, 1.02 pad 1.88)
  Top 0.254: v23.88,34.42 24.89,35.43 26.29,35.43 26.8,35.94 26.8,36.7 26.29,37.21 26.04,37.21 25.61,37.64 U2.3 25.61,40.09 25.91,40.39 25.91,41.15 25.27,41.78 v25.27,44.45 | 32.38,18.41 PROGRAM.4 v29.21,19.68 | 32.38,18.41 PROGRAM.3 | R3.2 32.4,18.43 32.38,18.41
  Bottom 0.254: v12.7,63.5 11.43,62.23 11.43,60.2 16.26,55.37 20.32,55.37 21.59,54.1 21.59,52.07 JP5.8 22.86,46.86 v25.27,44.45 | v23.88,34.42 23.88,31.5 21.97,29.59 21.97,24.77 27.05,19.68 v29.21,19.68
N$31  (via drill 1.02 pad 1.88)
  Top 0.254: v30.48,63.5 29.21,62.23 29.21,59.94 25.65,56.39 20.83,56.39 JP6.10 19.05,52.07 19.05,50.04 18.54,49.53 17.02,49.53 14.99,47.5 14.99,35.18 15.89,34.27 U2.22
N$110
  Top 0.254: U2.56 32.9,32.77 C5.A 34.16,32.89 34.68,32.37 C4.1
RC13
  Top 0.254: U2.47 26.11,26.21 26.42,25.91 27.43,25.91 28.45,26.92 35.31,26.92 37.08,25.15 37.08,16.26 JP7.14
RC14
  Top 0.254: U2.48 26.61,26.48 26.67,26.42 27.18,26.42 28.19,27.43 35.56,27.43 37.59,25.4 37.59,18.29 JP7.13
RD0
  Top 0.254: JP7.12 38.1,20.32 38.1,25.65 35.81,27.94 29.97,27.94 29.21,28.7 25.91,28.7 25.61,28.4 U2.46
RD1
  Top 0.254: U2.49 29.4,29.27 30.23,28.45 36.07,28.45 38.61,25.91 38.61,22.35 JP7.11
RD2
  Top 0.254: U2.50 29.67,29.77 30.48,28.96 36.32,28.96 39.12,26.16 39.12,24.38 JP7.10
RD3
  Top 0.254: JP7.9 36.58,29.46 30.73,29.46 29.93,30.27 U2.51
RD4
  Top 0.254: U2.52 30.19,30.77 30.99,29.97 38.61,29.97 JP7.8
RD5
  Top 0.254: U2.53 30.45,31.27 31.24,30.48 JP7.7
RD6
  Top 0.254: U2.54 30.71,31.77 31.5,30.99 38.61,30.99 JP7.6
RD7
  Top 0.254: U2.55 30.98,32.27 31.75,31.5 36.58,31.5 JP7.5
RD8  (via drill 0.51)
  Top 0.254: U2.42 23.62,27.43 23.62,28.45 24.89,29.72 v26.67,29.72
  Bottom 0.254: v26.67,29.72 27.69,28.7 27.69,25.4 28.45,24.64 31.5,24.64 39.12,32.26 39.12,36.58 JP7.4
RD10  (via drill 0.51, 1.02 pad 1.88)
  Top 0.254: 24.64,27.39 U2.44 24.61,26.19 25.91,24.89 29.21,24.89 v30.23,25.91 | JP7.2 41.91,44.45 41.91,54.36 41.4,54.86 39.88,54.86 38.35,56.39 38.35,57.78 40.01,59.44 41.4,59.44 41.91,59.94 41.91,64.26 41.4,64.77 9.4,64.77 8.89,64.26 8.89,62.23 v7.62,60.96
  Bottom 0.254: v30.23,25.91 31.24,26.92 32.26,26.92 38.1,32.77 38.1,40.64 JP7.2
RD11  (via drill 0.51)
  Top 0.254: 25.15,27.38 U2.45 25.11,26.45 26.16,25.4 28.45,25.4 v28.96,25.91
  Bottom 0.254: v28.96,25.91 30.48,27.43 32,27.43 37.59,33.02 37.59,42.67 JP7.1
RE0  (via drill 0.51, 1.02 pad 1.88)
  Top 0.254: U2.60 30.2,34.77 31.24,35.81 31.24,38.86 v31.75,39.37 | v27.18,22.86 USB.C
  Bottom 0.254: v27.18,22.86 24.26,25.78 24.26,29.72 26.92,32.38 32.64,32.38 34.29,34.04 34.29,38.1 33.02,39.37 v31.75,39.37 31.75,40.64 40.64,49.53 JP5.1 40.64,51.31 39.37,52.58 39.37,54.1 34.54,58.93 21.34,58.93 20.32,59.94 v20.32,60.96
RE1  (via drill 0.51, 1.02 pad 1.88)
  Top 0.254: U2.61 29.94,35.27 30.73,36.07 30.73,40.89 v32.89,43.05
  Bottom 0.254: v32.89,43.05 38.1,48.26 JP5.2 38.1,51.31 36.83,52.58 36.83,54.1 32.51,58.42 20.57,58.42 19.05,59.94 19.05,62.23 v20.32,63.5
RE2  (via drill 0.51, 1.02 pad 1.88)
  Top 0.254: U2.62 29.67,35.77 30.23,36.32 30.23,41.66 v31.62,43.05
  Bottom 0.254: v31.62,43.05 35.56,46.99 JP5.3 35.56,51.31 34.29,52.58 34.29,54.1 30.48,57.91 19.81,57.91 17.78,59.94 v17.78,60.96
RF0  (via drill 0.51)
  Top 0.254: U2.58 25.92,33.77 v25.27,34.42
  Bottom 0.254: v25.27,34.42 25.91,33.78 27.43,33.78 27.94,34.29 27.94,40.13 24.38,43.69 24.38,44.2 20.32,48.26 JP5.9
RF1  (via drill 0.51)
  Top 0.254: v26.92,34.8 27.45,34.27 U2.59
  Bottom 0.254: v26.92,34.8 26.92,40.39 23.88,43.43 23.88,43.94 17.78,50.04 JP5.10
RF4  (via drill 0.51, 1.02 pad 1.88)
  Top 0.254: U2.31 14.91,29.77 v14.35,29.21 | v13.46,35.81 13.46,47.75 15.24,49.53 JP5.11
  Bottom 0.254: v14.35,29.21 13.46,30.1 v13.46,35.81 | JP5.11 16.51,52.07 16.51,54.36 10.16,60.71 v10.16,60.96
RF5  (via drill 0.51, 1.02 pad 1.88)
  Top 0.254: U2.32 15.68,29.27 14.73,28.32 13.84,28.32 v12.95,29.21 | v11.43,35.81 11.43,48.26 12.7,49.53 JP5.12
  Bottom 0.254: v12.95,29.21 12.95,34.29 v11.43,35.81 | JP5.12 13.97,52.07 13.97,56.13 10.41,59.69 9.4,59.69 8.89,60.2 8.89,62.23 v10.16,63.5
RG6  (via drill 0.51, 0.51 pad 1.02, 1.02 pad 1.88)
  Top 0.254: v24.89,40.77 25.11,40.55 U2.4 | v7.62,57.15 6.35,57.15 v2.54,60.96
  Bottom 0.254: v24.89,40.77 24.26,40.77 22.23,42.8 12.83,42.8 10.16,45.47 JP5.13 11.43,52.07 11.43,54.1 9.91,55.63 9.14,55.63 v7.62,57.15
RG7  (via drill 0.51, 0.51 pad 1.02, 1.02 pad 1.88)
  Top 0.254: U2.5 24.61,37.62 v25.91,36.32 | v8.89,57.15 7.87,58.17 6.1,58.17 4.06,60.2 4.06,61.98 v2.54,63.5
  Bottom 0.254: v25.91,36.32 25.91,38.35 21.97,42.29 12.57,42.29 7.62,47.24 JP5.14 8.89,52.07 8.89,54.1 6.6,56.39 6.6,57.4 7.37,58.17 7.87,58.17 v8.89,57.15
RG8  (via drill 0.51, 0.51 pad 1.02, 1.02 pad 1.88)
  Top 0.254: U2.6 24.11,36.72 v24.51,36.32 | v10.16,57.15 8.64,58.67 6.35,58.67 4.57,60.45 4.57,64.01 v2.54,66.04
  Bottom 0.254: v24.51,36.32 24.51,38.99 21.72,41.78 12.32,41.78 5.08,49.02 JP5.15 6.35,52.07 6.35,55.88 6.1,56.13 6.1,57.66 7.11,58.67 8.64,58.67 v10.16,57.15
RG9  (via drill 0.51, 0.51 pad 1.02, 1.02 pad 1.88)
  Top 0.254: U2.8 23.11,36.32 v22.73,35.94 | v11.43,57.15 9.4,59.18 6.6,59.18 5.08,60.71 5.08,66.04 v2.54,68.58
  Bottom 0.254: v22.73,35.94 22.73,40.01 21.46,41.27 12.06,41.27 JP5.16 3.81,52.07 3.81,54.1 5.59,55.88 5.59,57.91 6.86,59.18 9.4,59.18 v11.43,57.15
USBID  (via drill 0.51)
  Top 0.254: U2.33 19.11,26.09 18.29,25.27 18.29,23.11 v17.78,22.61 15.88,22.61 14.35,24.13 R9.1 | JP12.4 13.21,12.7 12.45,11.94 12.45,9.4 12.23,9.18 JP3.ID
  Bottom 0.254: JP12.4 16.26,14.22 16.26,21.08 v17.78,22.61
V+
  Bottom 0.61: JP8.1 JP8.2 JP8.3 JP8.4 JP8.5 JP8.6 JP8.7 JP8.8 JP8.9 JP8.10 JP8.11 JP8.12 JP8.13 JP8.14 7.37,66.04 4.83,63.5 4.83,56.13 3.56,54.86 1.78,54.86 0.89,53.98 0.89,34.67 1.91,33.66 3.17,33.66 JP13.2
VBUS  (via drill 0.51)
  Top 0.254: JP12.1 18.8,21.34 18.8,25.02 19.61,25.83 U2.34 | v19.81,14.22 20.32,13.72 F1.2 20.32,11.18
  Top 0.61: S1.3 S1.6 20.99,6.63 22.1,7.75 22.1,9.8 F1.2
  Bottom 0.254: JP12.1 19.81,18.29 v19.81,14.22
~MCLR  (via drill 0.51)
  Top 0.254: U2.7 23.61,35.55 v22.48,34.42 | RESET.3 RESET.4 21.59,19.43 v21.84,19.68 | 16,25.4 R10.2 | v16.64,26.04 16,25.4 | 16,25.4 v16,23.75
  Bottom 0.254: v22.48,34.42 21.84,33.78 21.84,31.24 v16.64,26.04 11.05,26.04 9.14,27.94 9.14,32.26 8.13,33.27 7.37,33.27 5.33,35.31 5.33,42.93 JP10.1 | v16,23.75 19.05,23.75 21.84,20.95 v21.84,19.68

### Text on the board
Bottom: 2011-08-27
tPlace: SPI | SS | SS | GND | GND | MO | V* | V* | SDA | B1 | MI | SCK | SCL | B0 | I2C | TX | E0-7 (DIG) | B0-15 (AN max 3.3V) | 7 | 5 | 5 | 5 | 3 | 3 | 1 | F | D | B | 9 | 7 | 5 | 3 | RX | RX | 6 | 4 | 4 | 2 | 2 | 0 | E | C | A | 8 | 6 | 4 | 2 | B15 | B0 | G9 | G8 | G7 | G6 | F5 | F4 | F1 | F0 | E7 | E6 | E5 | E4 | E3 | E2 | E1 | E0 | D11 | ~MCLR | D10 | 3.3V | CUI32Stem | Overtone-labs.com | D9 | GND | D8 | 5V tolerant | PGED1 | D7 | PGEC1 | D6 | 3.3V | V* | JUMPER | D5 | V+ | D4 | V+ | D3 | GND | STATUS | 3.3V | D2 | HOST | VBUS | D1 | D- | D0 | D+ | C14 | ID | RESET | PROG | C13 | DEVICE | GND | GND | POWER | USB | BAT
bPlace: SPI | SS | GND | GND | MO | V* | V* | SDA | B1 | MI | SCK | SCL | B0 | I2C | TX | E0-7 (DIG) | B0-15 (AN max 3.3V) | 7 | 5 | 3 | 1 | F | D | B | 9 | 7 | 5 | 3 | RX | 6 | 4 | 2 | 0 | E | C | A | 8 | 6 | 4 | 2 | B0 | B15 | G9 | G8 | G7 | G6 | F1 | F0 | E7 | E6 | E5 | E4 | E3 | E2 | E1 | E0 | D11 | ~MCLR | D10/SCL1 | 3.3V | TX3A(O)/F5 | RX3A(I)/F4 | D9/SDA1 | GND | D8 | PGED1 | D7 | PGEC1 | layout refined by | D6 | 3.3V | V* | Markus Gritsch | JUMPER | D5 | 5V tolerant | V+ | D4 | GND | 3.3V | D3 | V+ | seeedstudio.com | D2 | D1 | USB Host | VBUS | D0 | D- | C14 | D+ | C13 | USBID | GND | GND | 3.5V-10V | (5V for USB Host) | + | -